# Altium schematic sheet Ports.SchDoc
size A
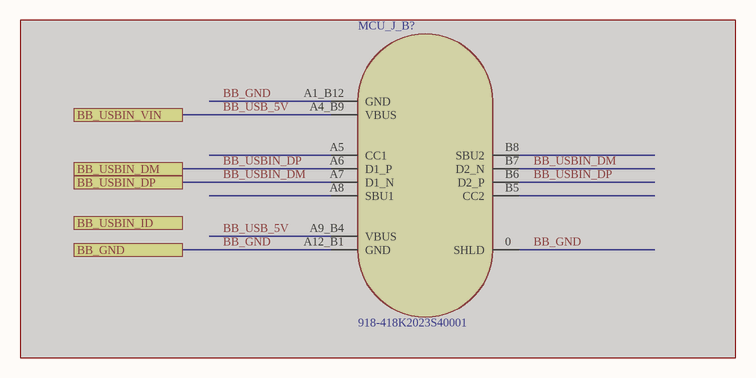
[diagram p0: Ports.SchDoc]

## Parts
MCU_J_B?  918-418K2023S40001  [DX07S016JA1R1500]  (masked out: inside a compile mask, not in the netlist)

## Ports
BB_GND, BB_USBIN_DM, BB_USBIN_DP, BB_USBIN_ID, BB_USBIN_VIN

## Library data of the parts
MCU_J_B? = 918-418K2023S40001: J - JACK - USB - Type C - Recepticle - SMT - 90°; JLC Availability: LCSC; LCSC Part #: C167321